# Altium schematic sheet Boost_Converter.SchDoc
size A4; SheetNumber: 3; SheetTotal: 6
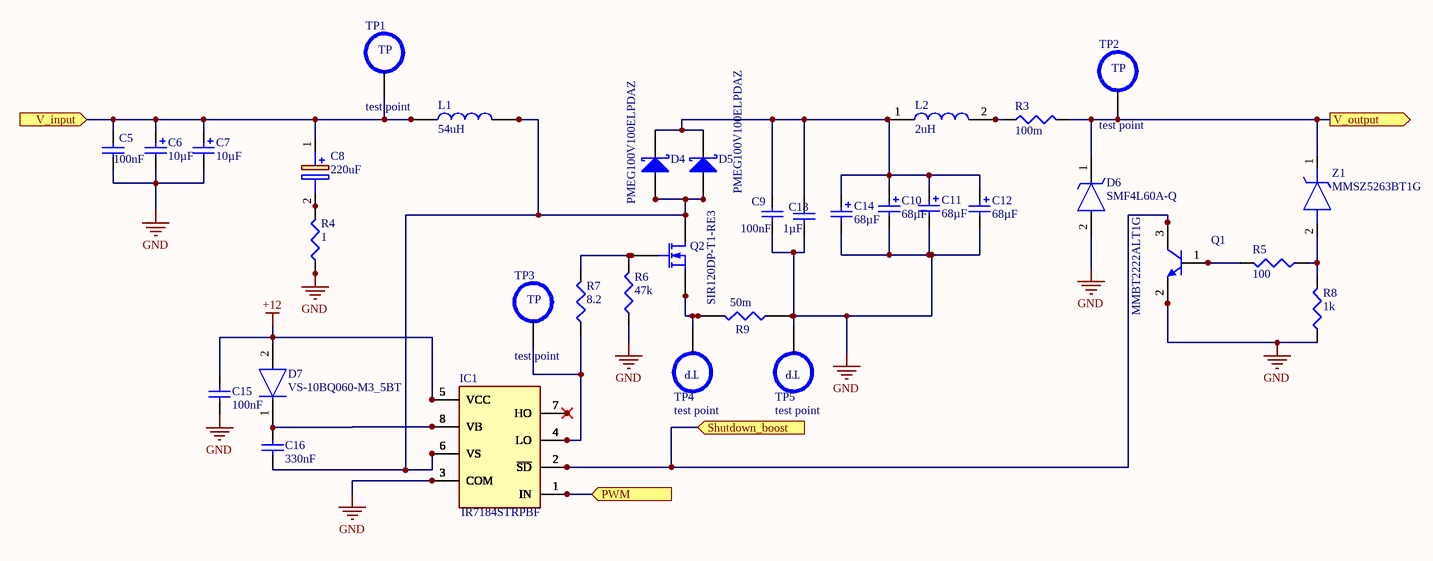
[diagram p0: Boost_Converter.SchDoc]

## Parts
C5  value 100nF  [CAPC3216X180N]  (hidden comment: CC1206KKX7R0BB104)
C6  value 10µF  [870056174001]  (hidden comment: 870056174001)
C7  value 10µF  [870056174001]  (hidden comment: 870056174001)
C8  value 220uF  [CAPPRD500W60D1275H2700]  (hidden comment: 100ZLJ220M12.5X25)
C9  value 100nF  [CAPC3216X180N]  (hidden comment: CC1206KKX7R0BB104)
C10  EGXF251ELL680MK30S: 68µF  [EGXF251ELL680MK30S]  (hidden comment: EGXF251ELL680MK30S)
C11  EGXF251ELL680MK30S: 68µF  [EGXF251ELL680MK30S]  (hidden comment: EGXF251ELL680MK30S)
C12  EGXF251ELL680MK30S: 68µF  [EGXF251ELL680MK30S]  (hidden comment: EGXF251ELL680MK30S)
C13  value 1µF  [CAPC3216X180N]  (hidden comment: C1206C105M5REC7210)
C14  EGXF251ELL680MK30S: 68µF  [EGXF251ELL680MK30S]  (hidden comment: EGXF251ELL680MK30S)
C15  100nF  [CAPC3216X180N]
C16  330nF  [CAPC3216X180N]
D4  PMEG100V100ELPDAZ  [PMEG100V100ELPDAZ]
D5  PMEG100V100ELPDAZ  [PMEG100V100ELPDAZ]
D6  SMF4L60A-Q  [SODFL3716X135N]
D7  VS-10BQ060-M3_5BT  [DIOM5436X244N]
IC1  IR7184STRPBF  [SOIC127P600X175-8N]
L1  value 54uH  [SHBC201R7A0054V]  (hidden comment: SHBC20-1R7A0054V)
L2  value 2uH  [SRP1510CA100M]  (hidden comment: SRP1580CA-2R0M)
Q1  MMBT2222ALT1G  [SOT96P237X111-3N]
Q2  SIR120DP-T1-RE3  [SI7141DPT1GE3]
R3  value 100m  [RESC6331X80N]  (hidden comment: CRM2512-FX-R100ELF)
R4  value 1  [RESC6432X120N]  (hidden comment: 35221R0JT)
R5  value 100  [RESC3216X75N]  (hidden comment: 100Ω)
R6  value 47k  [RESC3216X75N]  (hidden comment: MCWR12X4702FTL)
R7  value 8.2  [RESC3216X75N]  (hidden comment: MCWR12W8R20FTL)
R8  value 1k  [RESC3216X75N]  (hidden comment: 1KΩ)
R9  value 50m  [RESC7146X175N]  (hidden comment: WSHM2818R0500FEB)
TP1  test point  [Test point]
TP2  test point  [Test point]
TP3  test point  [Test point]
TP4  test point  [Test point]
TP5  test point  [Test point]
Z1  MMSZ5263BT1G  [SOD3716X135N]

## Ports
PWM (in), Shutdown_boost (in), V_input (in), V_output (out)

## Nets
+12: C15.2 D7.2(A) IC1.5(VCC)
GND: C5.2 C6.2 C7.2 C9.2 C10.2 C11.2 C12.2 C13.1 C14.2 C15.1 D6.2(A) IC1.3(COM) Q1.2(E) R4.1 R6.1 R8.1 R9.1 TP5.5
PWM: IC1.1(IN) ; port PWM
Shutdown_boost: IC1.2(~{SD}) Q1.3(C) ; port Shutdown_boost
V_input: C5.1 C6.1 C7.1 C8.1(+) L1.1 TP1.5 ; port V_input
V_output: D6.1(K) R3.2 TP2.5 Z1.1(K) ; port V_output
NetC8_2: C8.2(-) R4.2
NetC9_1: C9.1 C10.1 C11.1 C12.1 C13.2 C14.1 D4.3(K) D5.3(K) L2.1
NetC16_1: C16.1 D4.1(A_1) D4.2(A_2) D5.1(A_1) D5.2(A_2) IC1.6(VS) L1.2 Q2.5(D) Q2.6(D) Q2.7(D) Q2.8(D)
NetC16_2: C16.2 D7.1(K) IC1.8(VB)
NetIC1_4: IC1.4(LO) R7.1 TP3.5
NetL2_2: L2.2 R3.1
NetQ1_1: Q1.1(B) R5.2
NetQ2_1: Q2.1(G) R6.2 R7.2
NetQ2_2: Q2.2(S) Q2.3(S) Q2.4(S) R9.2 TP4.5
NetR5_1: R5.1 R8.2 Z1.2(A)

Not connected (* = marked no-connect by the designer): IC1 7(HO)*

## Notes on the sheet
- (in symbol test point) TP

## Library data of the parts
C5 C9 C15 = CC1206KKX7R0BB104: Capacitor 100nF; Published: 8-Jun-2000; LatestRevisionDate: 17-Jul-2002; LatestRevisionNote: Re-released for DXP Platform.; PackageReference: RAD-0.3; Publisher: Altium Limited; PackageDescription: Radial Cap, Thru-Hole; 2 Leads; 0.3 in Pin Spacing; Supplier 1: Farnell
  C15: Value: 100nF
C6 C7 = 870056174001: Capacitor Polarised 10uF; Manufacturer_Name: Panasonic; Manufacturer_Part_Number: EEV-FK1K101V; Datasheet Link: http://industrial.panasonic.com/cdbs/www-data/pdf/RDE0000/ABA0000C1181.pdf; Height: 14.3mm; Mouser Part Number: 667-EEV-FK1K101V; Mouser Price/Stock: https://www.mouser.co.uk/ProductDetail/Panasonic/EEV-FK1K101V?qs=MtOUKumLmnbTFvRMlB7%2FdA%3D%3D
C8 = 100ZLJ220M12.5X25: Capacitor Polarised; Manufacturer_Name: Rubycon; Datasheet Link: https://componentsearchengine.com/Datasheets/2/100ZLJ220M12.5X25.pdf; Height: 27mm; Manufacturer_Part_Number: 100ZLJ220M12.5X25; Mouser Part Number: 232-100ZLJ220M125X25; Mouser Price/Stock: https://www.mouser.com/Search/Refine.aspx?Keyword=232-100ZLJ220M125X25; Arrow Part Number: 100ZLJ220M12.5X25; Arrow Price/Stock: https://www.arrow.com/en/products/100zlj220m12.5x25/rubycon
C10-C12 C14 = EGXF251ELL680MK30S: Capacitor 68uF; Manufacturer_Name: Panasonic; Manufacturer_Part_Number: EEV-FK1K101V; Value: 68µF; Datasheet Link: http://industrial.panasonic.com/cdbs/www-data/pdf/RDE0000/ABA0000C1181.pdf; Height: 14.3mm; Mouser Part Number: 667-EEV-FK1K101V; Mouser Price/Stock: https://www.mouser.co.uk/ProductDetail/Panasonic/EEV-FK1K101V?qs=MtOUKumLmnbTFvRMlB7%2FdA%3D%3D
C13 = C1206C105M5REC7210: Capacitor 1uF; Published: 8-Jun-2000; LatestRevisionDate: 17-Jul-2002; LatestRevisionNote: Re-released for DXP Platform.; PackageReference: RAD-0.3; Publisher: Altium Limited; PackageDescription: Radial Cap, Thru-Hole; 2 Leads; 0.3 in Pin Spacing; Supplier 1: Farnell
C16 = C3216X7R2A334K130AA: Capacitor 330nF; Published: 8-Jun-2000; LatestRevisionDate: 17-Jul-2002; LatestRevisionNote: Re-released for DXP Platform.; PackageReference: RAD-0.3; Publisher: Altium Limited; PackageDescription: Radial Cap, Thru-Hole; 2 Leads; 0.3 in Pin Spacing; Supplier 1: Mouser; Value: 330nF
D4 D5 = PMEG100V100ELPDAZ: Diode; Manufacturer_Name: Nexperia; Datasheet Link: https://assets.nexperia.com/documents/data-sheet/PMEG100V100ELPD.pdf; Height: 0.82mm; Manufacturer_Part_Number: PMEG100V100ELPDAZ; Mouser Part Number: 771-MEG100V100ELPDAZ; Mouser Price/Stock: https://www.mouser.co.uk/ProductDetail/Nexperia/PMEG100V100ELPDAZ?qs=64Y9EYqwa9iK90zZrx4xYg%3D%3D; Arrow Part Number: PMEG100V100ELPDAZ; Arrow Price/Stock: https://www.arrow.com/en/products/pmeg100v100elpdaz/nexperia
D6 = SMF4L60A-Q: TVS Diode (Uni-directional); Manufacturer_Name: Bourns; Datasheet Link: https://bourns.com/docs/product-datasheets/smf4l-q.pdf; Height: 1.35mm; Manufacturer_Part_Number: SMF4L60A-Q; Mouser Part Number: 652-SMF4L60A-Q; Mouser Price/Stock: https://www.mouser.co.uk/ProductDetail/Bourns/SMF4L60A-Q?qs=iLbezkQI%252BsjmazDMS%252BOglQ%3D%3D
D7 = VS-10BQ060-M3_5BT: Diode; Manufacturer_Name: Vishay; Manufacturer_Part_Number: VS-10BQ060-M3/5BT; Datasheet Link: https://componentsearchengine.com/Datasheets/1/VS-10BQ060-M3_5BT.pdf; Height: 2.44mm; Mouser Part Number: 78-VS-10BQ060-M35BT; Mouser Price/Stock: https://www.mouser.co.uk/ProductDetail/Vishay-Semiconductors/VS-10BQ060-M3-5BT/?qs=asPD7ZL2j3Xpjq4X%2F1O06Q%3D%3D; Arrow Part Number: VS-10BQ060-M3/5BT; Arrow Price/Stock: https://www.arrow.com/en/products/vs-10bq060-m35bt/vishay
IC1 = IR7184STRPBF: Integrated Circuit; Manufacturer_Name: Infineon; Datasheet Link: https://componentsearchengine.com/Datasheets/1/IR7184STRPBF.pdf; Height: 1.75mm; Manufacturer_Part_Number: IR7184STRPBF; Mouser Part Number: 942-IR7184STRPBF; Mouser Price/Stock: https://www.mouser.com/Search/Refine.aspx?Keyword=942-IR7184STRPBF; Arrow Part Number: IR7184STRPBF; Arrow Price/Stock: https://www.arrow.com/en/products/ir7184strpbf/infineon-technologies-ag
L1 = SHBC20-1R7A0054V: Inductor 54uH
L2 = SRP1580CA-2R0M: Inductor 2uH; Manufacturer_Name: Bourns; Manufacturer_Part_Number: SRP1038C-100M; Datasheet Link: https://www.bourns.com/data/global/pdfs/SRP1038A.pdf; Height: 4mm; Mouser Part Number: 652-SRP1038C-100M; Mouser Price/Stock: https://www.mouser.co.uk/ProductDetail/Bourns/SRP1038C-100M?qs=PzGy0jfpSMvAa%252BP05u%252BK2w%3D%3D; Arrow Part Number: SRP1038C-100M; Arrow Price/Stock: https://www.arrow.com/en/products/srp1038c-100m/bourns
Q1 = MMBT2222ALT1G: NPN transistor; Manufacturer_Name: ON Semiconductor; Datasheet Link: http://www.onsemi.com/pub/Collateral/MMBT2222LT1-D.PDF; Height: 1.11mm; Manufacturer_Part_Number: MMBT2222ALT1G; Mouser Part Number: 863-MMBT2222ALT1G; Mouser Price/Stock: https://www.mouser.co.uk/ProductDetail/onsemi/MMBT2222ALT1G?qs=HVbQlW5zcXWwnD7Jokybqg%3D%3D; Arrow Part Number: MMBT2222ALT1G; Arrow Price/Stock: https://www.arrow.com/en/products/mmbt2222alt1g/on-semiconductor
Q2 = SIR120DP-T1-RE3: MOSFET (N-Channel); Manufacturer_Name: Vishay; Datasheet Link: http://www.vishay.com/docs/79731/sir120dp.pdf; Manufacturer_Part_Number: SIR120DP-T1-RE3; Mouser Part Number: 78-SIR120DP-T1-RE3; Mouser Price/Stock: https://www.mouser.co.uk/ProductDetail/Vishay-Semiconductors/SIR120DP-T1-RE3?qs=UkDUCjYnTB3xEXzKpvDZuA%3D%3D; Arrow Part Number: SIR120DP-T1-RE3; Arrow Price/Stock: https://www.arrow.com/en/products/sir120dp-t1-re3/vishay
R3 = CRM2512-FX-R100ELF: Resistor 100m; Published: 8-Jun-2000; LatestRevisionDate: 29-May-2009; LatestRevisionNote: IPC-7351 Footprint Added.; PackageReference: J1-0603; Publisher: Altium Limited; PackageDescription: Chip Resistor; Supplier 1: Mouser
R4 = 35221R0JT: Resistor 1 3W; Published: 8-Jun-2000; LatestRevisionDate: 29-May-2009; LatestRevisionNote: IPC-7351 Footprint Added.; PackageReference: J1-0603; Publisher: Altium Limited; PackageDescription: Chip Resistor; Supplier 1: Farnell
R5 = MCWR12X1000FTL: Resistor 100; Published: 8-Jun-2000; LatestRevisionDate: 29-May-2009; LatestRevisionNote: IPC-7351 Footprint Added.; PackageReference: J1-0603; Publisher: Altium Limited; PackageDescription: Chip Resistor; Supplier 1: Farnell
R6 = MCWR12X4702FTL: Resistor 47k; Published: 8-Jun-2000; LatestRevisionDate: 29-May-2009; LatestRevisionNote: IPC-7351 Footprint Added.; PackageReference: J1-0603; Publisher: Altium Limited; PackageDescription: Chip Resistor; supplier: farnell
R7 = MCWR12W8R20FTL: Resistor 8.2; Published: 8-Jun-2000; LatestRevisionDate: 29-May-2009; LatestRevisionNote: IPC-7351 Footprint Added.; PackageReference: J1-0603; Publisher: Altium Limited; PackageDescription: Chip Resistor; Supplier 1: Farnell
R8 = MCHP06W2F1001T5E: Resistor 1k; Published: 8-Jun-2000; LatestRevisionDate: 29-May-2009; LatestRevisionNote: IPC-7351 Footprint Added.; PackageReference: J1-0603; Publisher: Altium Limited; PackageDescription: Chip Resistor; supplier: farnell; Supplier 1: Farnell
R9 = WSHM2818R0500FEB: Resistor 50m; Manufacturer_Name: Vishay; Datasheet Link: https://componentsearchengine.com/Datasheets/2/WSHM2818R0500FEB.pdf; Height: 1.75mm; Manufacturer_Part_Number: WSHM2818R0500FEB; Mouser Part Number: 71-WSHM2818R0500FEB; Mouser Price/Stock: https://www.mouser.com/Search/Refine.aspx?Keyword=71-WSHM2818R0500FEB
Z1 = MMSZ5263BT1G: Zener Diode; Manufacturer_Name: ON Semiconductor; Datasheet Link: http://www.onsemi.com/pub/Collateral/MMSZ5221BT1-D.PDF; Height: 1.35mm; Manufacturer_Part_Number: MMSZ5263BT1G; Mouser Part Number: 863-MMSZ5263BT1G; Mouser Price/Stock: https://www.mouser.co.uk/ProductDetail/onsemi/MMSZ5263BT1G?qs=ZpPixqFcBtxaamSEBIiIIg%3D%3D; Arrow Part Number: MMSZ5263BT1G; Arrow Price/Stock: https://www.arrow.com/en/products/mmsz5263bt1g/on-semiconductor?region=nac